# Altium project equalizadorS.PrjPcb
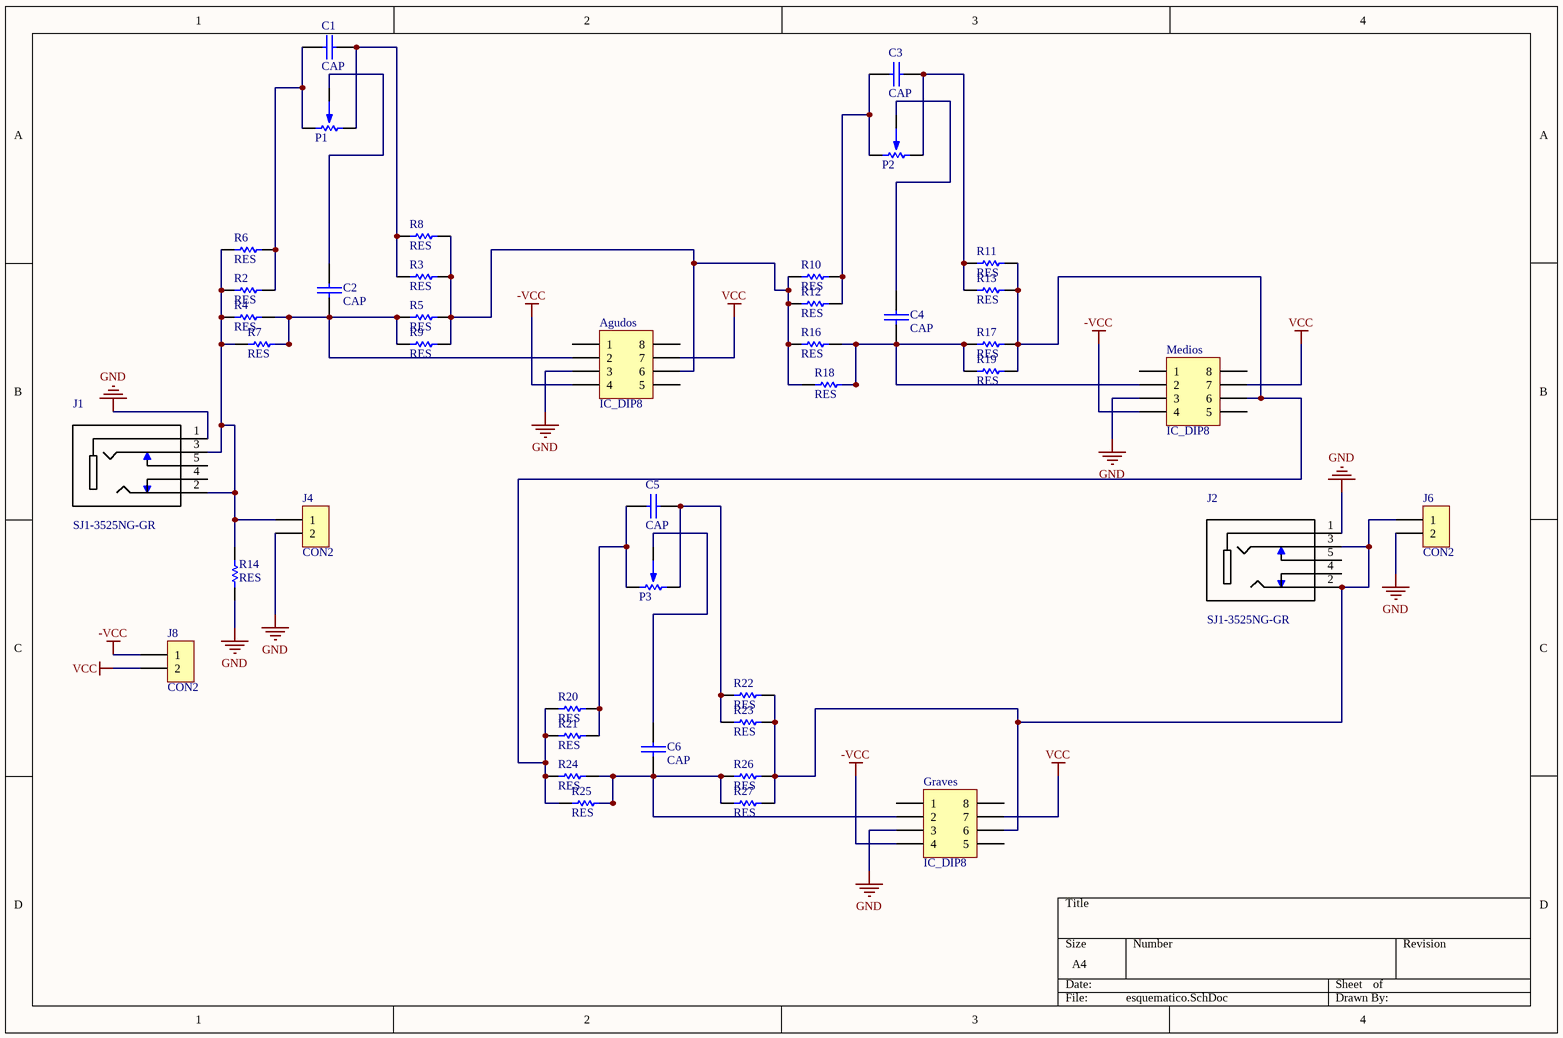
[diagram p0: esquematico.SchDoc]
1 sheet, 42 parts. Net scope: global (net labels, ports and power ports of the same name join across sheets).
Board file: plaqueta.PcbDoc

## Sheet esquematico.SchDoc
size A4

### Parts
Agudos  IC_DIP8  [DIP8]
C1  CAP  [CAP200]
C2  CAP  [CAP200]
C3  CAP  [CAP200]
C4  CAP  [CAP200]
C5  CAP  [CAP200]
C6  CAP  [CAP200]
Graves  IC_DIP8  [DIP8]
J1  SJ1-3525NG-GR  [CUI_SJ1-3525NG-GR]
J2  SJ1-3525NG-GR  [CUI_SJ1-3525NG-GR]
J4  CON2  [SIP2]
J6  CON2  [SIP2]
J8  CON2  [SIP2]
Medios  IC_DIP8  [DIP8]
P1  POTENCIOMETRO  [POTENCIOMETRO]  (value not drawn)
P2  POTENCIOMETRO  [POTENCIOMETRO]  (value not drawn)
P3  POTENCIOMETRO  [POTENCIOMETRO]  (value not drawn)
R2  RES  [RES400]
R3  RES  [RES400]
R4  RES  [RES400]
R5  RES  [RES400]
R6  RES  [RES400]
R7  RES  [RES400]
R8  RES  [RES400]
R9  RES  [RES400]
R10  RES  [RES400]
R11  RES  [RES400]
R12  RES  [RES400]
R13  RES  [RES400]
R14  RES  [RES400]
R16  RES  [RES400]
R17  RES  [RES400]
R18  RES  [RES400]
R19  RES  [RES400]
R20  RES  [RES400]
R21  RES  [RES400]
R22  RES  [RES400]
R23  RES  [RES400]
R24  RES  [RES400]
R25  RES  [RES400]
R26  RES  [RES400]
R27  RES  [RES400]

### Nets
-VCC: Agudos.4 Graves.4 J8.1 Medios.4
GND: Agudos.3 Graves.3 J1.1 J2.1 J4.2 J6.2 Medios.3 R14.1
VCC: Agudos.7 Graves.7 J8.2 Medios.7
NetAgudos_2: Agudos.2 C2.1 R4.2 R5.1 R7.2 R9.1
NetAgudos_6: Agudos.6 R3.2 R5.2 R8.2 R9.2 R10.1 R12.1 R16.1 R18.1
NetC1_1: C1.1 P1.1 R2.2 R6.2
NetC1_2: C1.2 P1.3 R3.1 R8.1
NetC2_2: C2.2 P1.2
NetC3_1: C3.1 P2.1 R10.2 R12.2
NetC3_2: C3.2 P2.3 R11.1 R13.1
NetC4_1: C4.1 Medios.2 R16.2 R17.1 R18.2 R19.1
NetC4_2: C4.2 P2.2
NetC5_1: C5.1 P3.1 R20.2 R21.2
NetC5_2: C5.2 P3.3 R22.1 R23.1
NetC6_1: C6.1 Graves.2 R24.2 R25.2 R26.1 R27.1
NetC6_2: C6.2 P3.2
NetGraves_6: Graves.6 J2.2 J2.3 J6.1 R22.2 R23.2 R26.2 R27.2
NetJ1_2: J1.2 J1.3 J4.1 R2.1 R4.1 R6.1 R7.1 R14.2
NetMedios_6: Medios.6 R11.2 R13.2 R17.2 R19.2 R20.1 R21.1 R24.1 R25.1

Not connected (* = marked no-connect by the designer): Agudos 1 5 8; Graves 1 5 8; J1 4 5; J2 4 5; Medios 1 5 8

### Library data of the parts
J1 J2 = SJ1-3525NG-GR: Value: *